# Altium schematic sheet BD.SchDoc
size A4; SheetNumber: 1; SheetTotal: 10
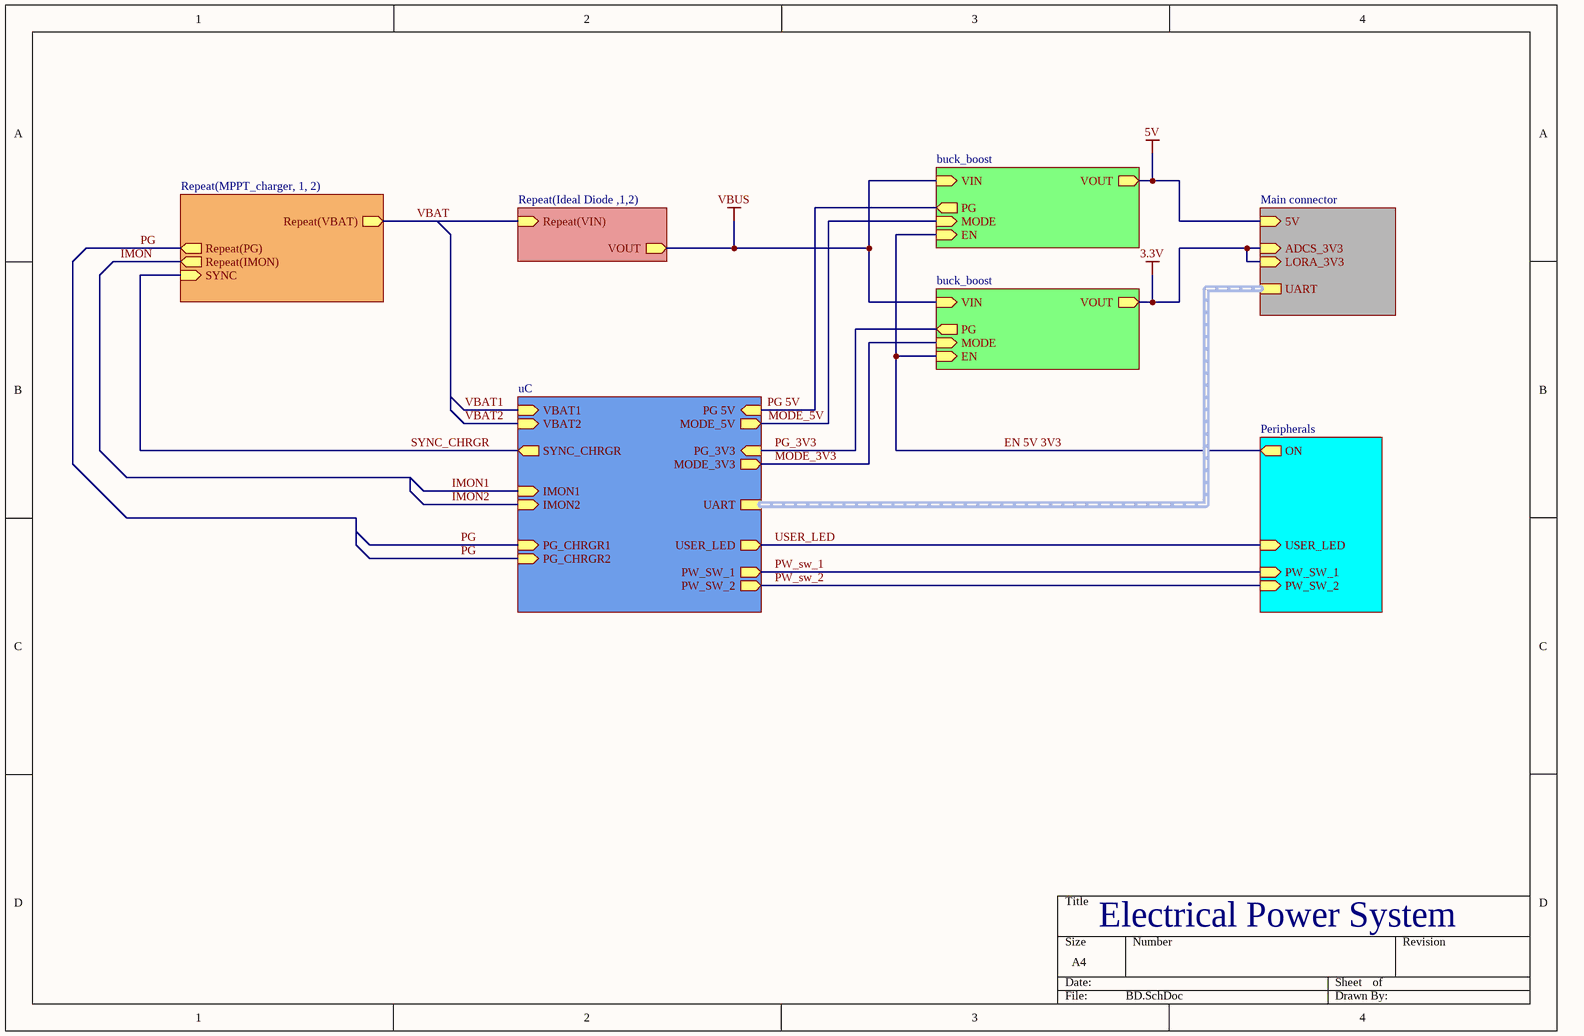
[diagram p0: BD.SchDoc]

## Sub-sheets
buck_boost = Buck-Boost converter (A).SchDoc: PG (out), VOUT (out), EN (in), MODE (in), VIN (in)
buck_boost = Buck-Boost converter (B).SchDoc: PG (out), VOUT (out), EN (in), MODE (in), VIN (in)
Main connector = Board-to-board connector.SchDoc: 5V (in), UART (harness UART), ADCS_3V3 (in), LORA_3V3 (in)
Peripherals = LED connector.SchDoc: USER_LED (in), ON (out), PW_SW_2 (in), PW_SW_1 (in)
Repeat(Ideal Diode ,1,2) = Ideal Diode (A).SchDoc: Repeat(VIN) (in), VOUT (out)
Repeat(MPPT_charger, 1, 2) = MPPT CC CV charger (A).SchDoc: Repeat(IMON) (out), SYNC (in), Repeat(PG) (out), Repeat(VBAT) (out)
uC = Microcontroller.SchDoc: IMON1 (in), IMON2 (in), PG_3V3 (in), SYNC_CHRGR (out), MODE_3V3 (out), PG 5V (in), MODE_5V (out), PG_CHRGR1 (in), PG_CHRGR2 (in), PW_SW_2 (out), PW_SW_1 (out), USER_LED (out), UART (harness UART), VBAT1 (in), VBAT2 (in)

## Nets
3.3V: sheet Main connector/ADCS_3V3, sheet Main connector/LORA_3V3, sheet buck_boost/VOUT
5V: sheet Main connector/5V, sheet buck_boost/VOUT
VBUS: sheet buck_boost/VIN, sheet buck_boost/VIN, sheet Repeat(Ideal Diode ,1,2)/VOUT
EN 5V 3V3: sheet buck_boost/EN, sheet buck_boost/EN, sheet Peripherals/ON
IMON: sheet Repeat(MPPT_charger, 1, 2)/Repeat(IMON)
IMON1: sheet uC/IMON1
IMON2: sheet uC/IMON2
MODE_3V3: sheet uC/MODE_3V3, sheet buck_boost/MODE
MODE_5V: sheet uC/MODE_5V, sheet buck_boost/MODE
PG: sheet uC/PG_CHRGR1, sheet uC/PG_CHRGR2, sheet Repeat(MPPT_charger, 1, 2)/Repeat(PG)
PG 5V: sheet uC/PG 5V, sheet buck_boost/PG
PG_3V3: sheet uC/PG_3V3, sheet buck_boost/PG
PW_sw_1: sheet uC/PW_SW_1, sheet Peripherals/PW_SW_1
PW_sw_2: sheet uC/PW_SW_2, sheet Peripherals/PW_SW_2
SYNC_CHRGR: sheet uC/SYNC_CHRGR, sheet Repeat(MPPT_charger, 1, 2)/SYNC
USER_LED: sheet uC/USER_LED, sheet Peripherals/USER_LED
VBAT: sheet Repeat(MPPT_charger, 1, 2)/Repeat(VBAT), sheet Repeat(Ideal Diode ,1,2)/Repeat(VIN)
VBAT1: sheet uC/VBAT1
VBAT2: sheet uC/VBAT2

## Buses and harness runs
harness sheet Main connector/UART = sheet uC/UART

## Notes on the sheet
- Electrical Power System